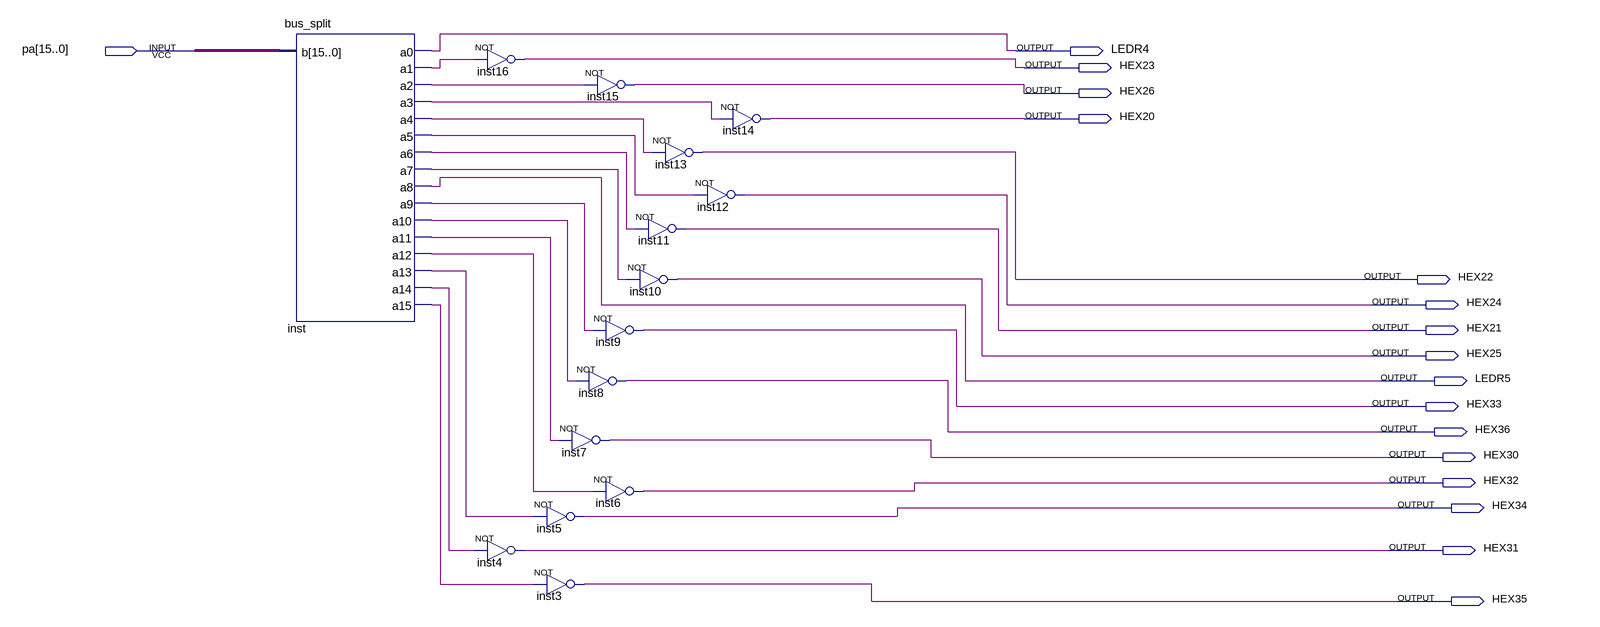
[diagram p0: schematic sheet]
// Quartus schematic display3.bdf as structural Verilog: 15 symbols, 17 pins
module display3 (
  input  [15:0] pa,
  output LEDR4,
  output HEX23,
  output HEX26,
  output HEX20,
  output HEX22,
  output HEX24,
  output HEX21,
  output HEX25,
  output LEDR5,
  output HEX33,
  output HEX36,
  output HEX30,
  output HEX32,
  output HEX34,
  output HEX31,
  output HEX35
);

  wire inst_a1, inst_a2, inst_a3, inst_a4, inst_a5, inst_a6, inst_a7, inst_a9, inst_a10, inst_a11, inst_a12,
       inst_a13, inst_a14, inst_a15;

  bus_split inst (
    .b(pa), .a0(LEDR4), .a1(inst_a1), .a2(inst_a2), .a3(inst_a3), .a4(inst_a4), .a5(inst_a5), .a6(inst_a6),
    .a7(inst_a7), .a8(LEDR5), .a9(inst_a9), .a10(inst_a10), .a11(inst_a11), .a12(inst_a12), .a13(inst_a13),
    .a14(inst_a14), .a15(inst_a15));
  not inst16 (HEX23, inst_a1);
  not inst4 (HEX31, inst_a14);
  not inst15 (HEX26, inst_a2);
  not inst8 (HEX36, inst_a10);
  not inst7 (HEX30, inst_a11);
  not inst5 (HEX34, inst_a13);
  not inst3 (HEX35, inst_a15);
  not inst13 (HEX22, inst_a4);
  not inst11 (HEX21, inst_a6);
  not inst10 (HEX25, inst_a7);
  not inst9 (HEX33, inst_a9);
  not inst6 (HEX32, inst_a12);
  not inst14 (HEX20, inst_a3);
  not inst12 (HEX24, inst_a5);
endmodule
